# Altium schematic sheet T-Clock.SchDoc
size 292 x 193 mm; Author: Power Lin; DocumentNumber: 1; Revision: 1B1; SheetNumber: 1; SheetTotal: 4; Website: wiki-power.com
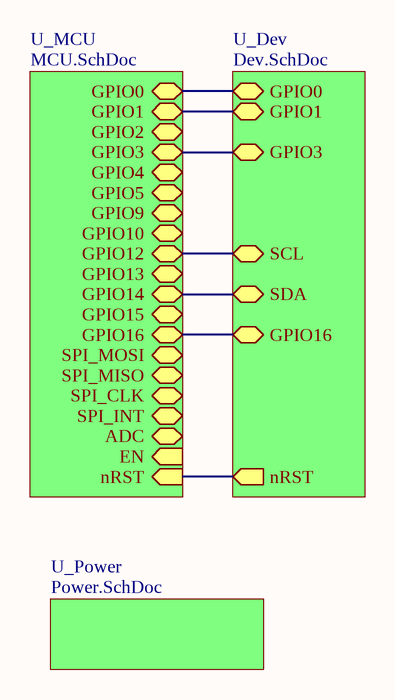
[diagram p0: T-Clock.SchDoc]

## Sub-sheets
U_Dev = Dev.SchDoc: GPIO16 (bidir), nRST (out), GPIO0 (bidir), SCL (bidir), SDA (bidir), GPIO3 (bidir), GPIO1 (bidir)
U_MCU = MCU.SchDoc: nRST (in), ADC (bidir), EN (in), GPIO16 (bidir), GPIO14 (bidir), GPIO12 (bidir), SPI_MOSI (bidir), SPI_MISO (bidir), GPIO9 (bidir), GPIO1 (bidir), GPIO3 (bidir), GPIO5 (bidir), GPIO4 (bidir), SPI_CLK (bidir), SPI_INT (bidir), GPIO10 (bidir), GPIO13 (bidir), GPIO0 (bidir), GPIO2 (bidir), GPIO15 (bidir)
U_Power = Power.SchDoc: no entries

## Nets
(unnamed): sheet U_MCU/nRST, sheet U_Dev/nRST
(unnamed): sheet U_MCU/GPIO16, sheet U_Dev/GPIO16
(unnamed): sheet U_MCU/GPIO14, sheet U_Dev/SDA
(unnamed): sheet U_MCU/GPIO12, sheet U_Dev/SCL
(unnamed): sheet U_MCU/GPIO1, sheet U_Dev/GPIO1
(unnamed): sheet U_MCU/GPIO3, sheet U_Dev/GPIO3
(unnamed): sheet U_MCU/GPIO0, sheet U_Dev/GPIO0

## Notes on the sheet
- Author
- DocumentName
- ModifiedDate
- ProjectName
- SheetNumber
- SheetTotal
- Website
- Revision